# EAGLE design PLCArduinoV1 (EAGLE 8.6.3)
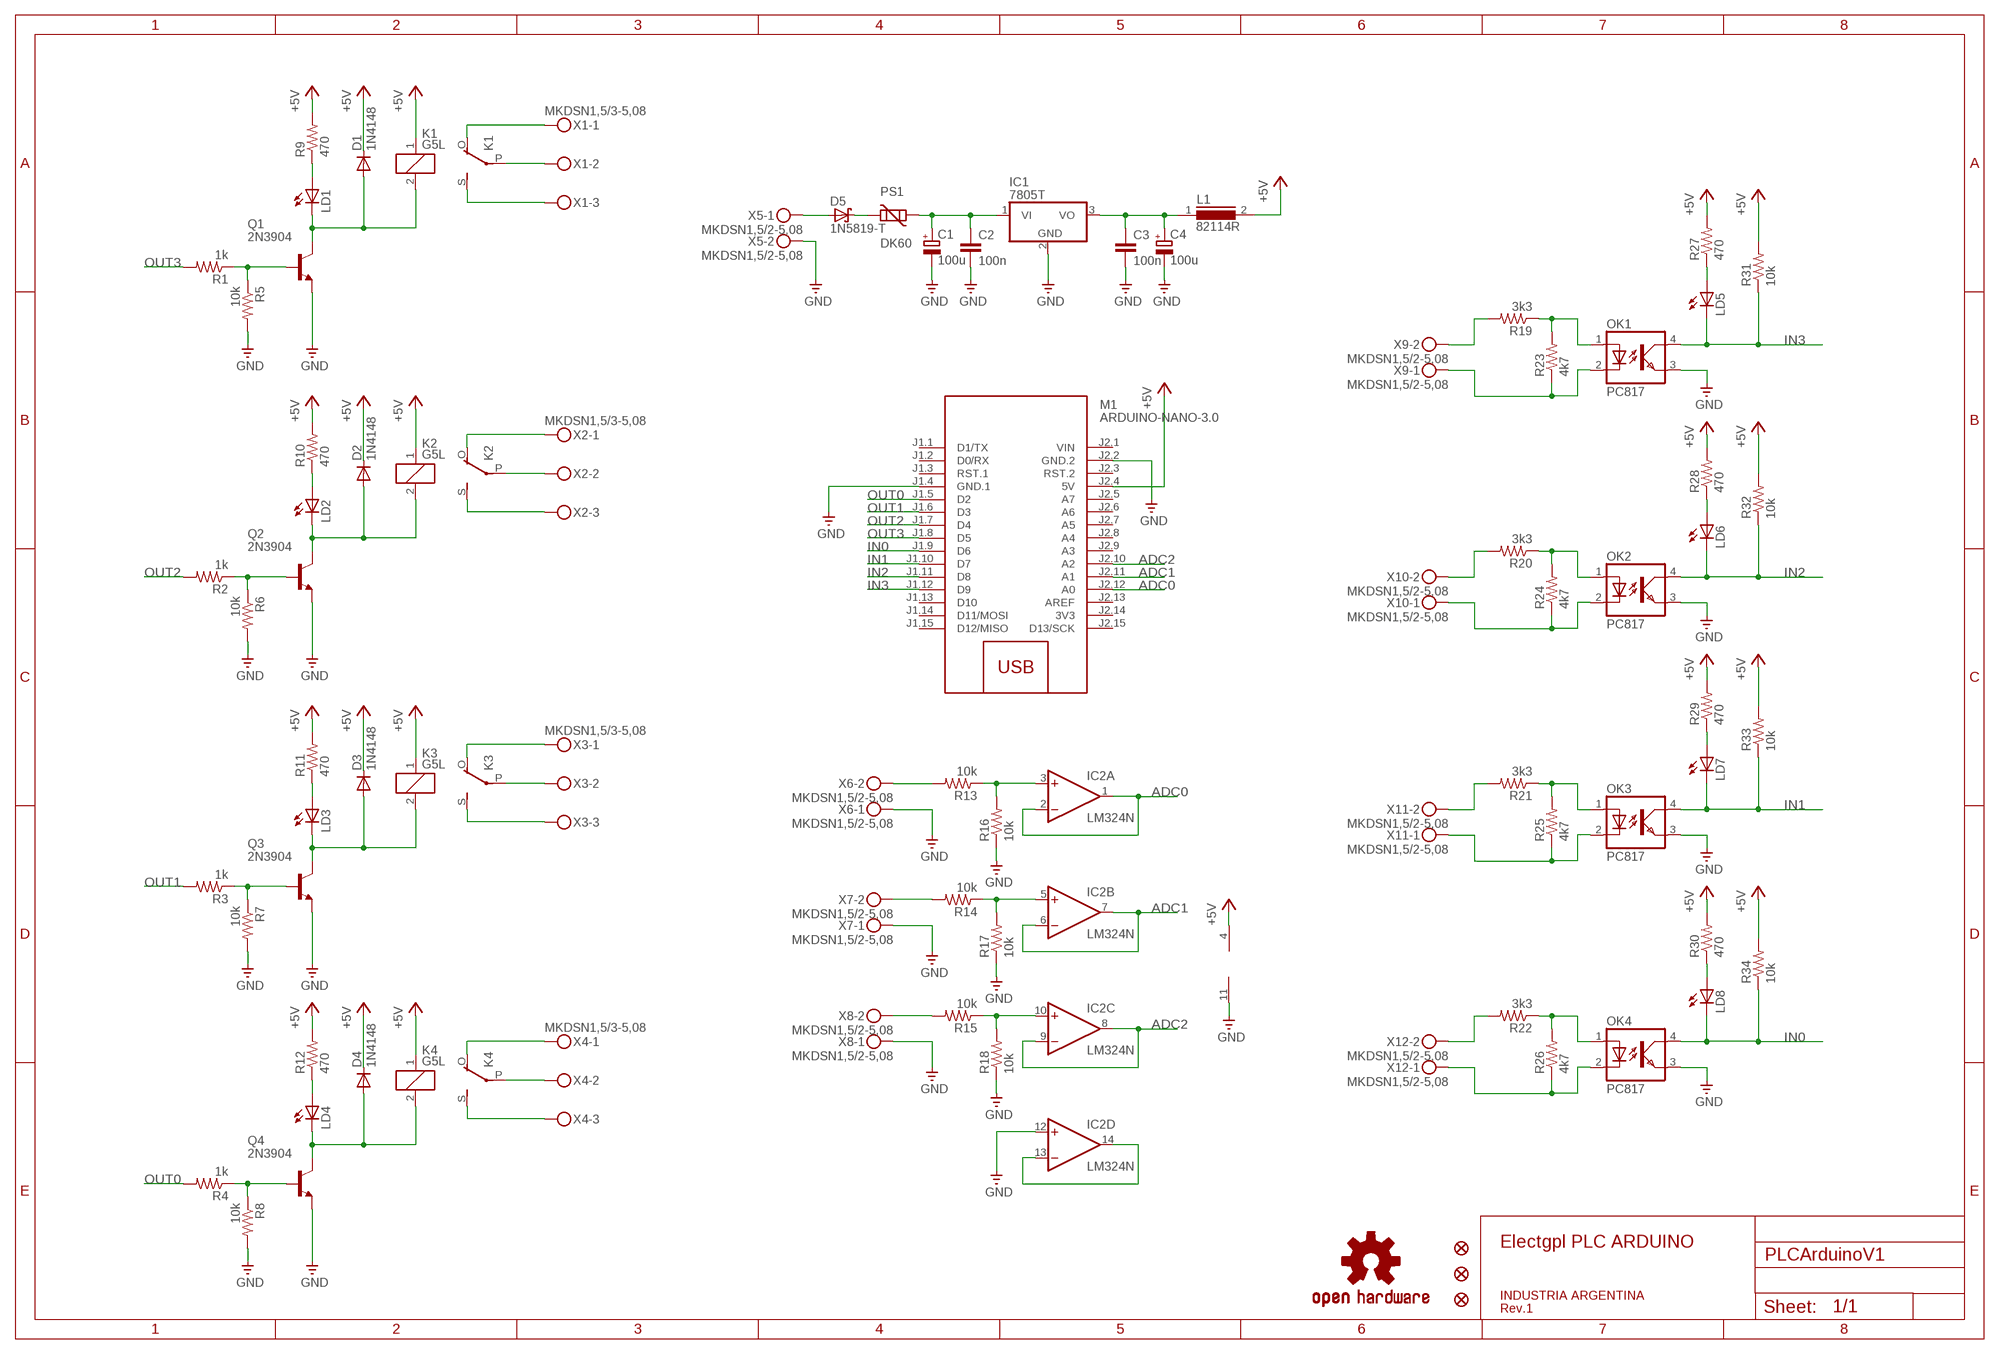
[diagram p0: schematic, sheet 1]

## Parts
C1  100u  CPOL-EUE3.5-8  [E3,5-8]
C2  100n  C-EU050-024X044  [C050-024X044]
C3  100n  C-EU050-024X044  [C050-024X044]
C4  100u  CPOL-EUE3.5-8  [E3,5-8]
D1  1N4148  [DO35-10]
D2  1N4148  [DO35-10]
D3  1N4148  [DO35-10]
D4  1N4148  [DO35-10]
D5  1N5819-T  [DO41-7.6]
IC1  7805T  [TO220H]
IC2  LM324N  [DIL14]
JP1  FIDUCIAL1X2.5  [FIDUCIAL-1X2.5]
JP2  FIDUCIAL1X2.5  [FIDUCIAL-1X2.5]
JP3  FIDUCIAL1X2.5  [FIDUCIAL-1X2.5]
K1  G5L  [G5LE]
K2  G5L  [G5LE]
K3  G5L  [G5LE]
K4  G5L  [G5LE]
L1  82114R  [82114R]
LD1  LED3MM  [LED3MM]
LD2  LED3MM  [LED3MM]
LD3  LED3MM  [LED3MM]
LD4  LED3MM  [LED3MM]
LD5  LED3MM  [LED3MM]
LD6  LED3MM  [LED3MM]
LD7  LED3MM  [LED3MM]
LD8  LED3MM  [LED3MM]
M1  ARDUINO-NANO-3.0  [ARDUINO-NANO-3.0]
OK1  PC817  [DIL04]
OK2  PC817  [DIL04]
OK3  PC817  [DIL04]
OK4  PC817  [DIL04]
PS1  DK60  POLYSWITCH5MM  [SO5K11]
Q1  2N3904  [TO92]
Q2  2N3904  [TO92]
Q3  2N3904  [TO92]
Q4  2N3904  [TO92]
R1  1k  R-US_0204/5  [0204/5]
R2  1k  R-US_0204/5  [0204/5]
R3  1k  R-US_0204/5  [0204/5]
R4  1k  R-US_0204/5  [0204/5]
R5  10k  R-US_0204/5  [0204/5]
R6  10k  R-US_0204/5  [0204/5]
R7  10k  R-US_0204/5  [0204/5]
R8  10k  R-US_0204/5  [0204/5]
R9  470  R-US_0204/5  [0204/5]
R10  470  R-US_0204/5  [0204/5]
R11  470  R-US_0204/5  [0204/5]
R12  470  R-US_0204/5  [0204/5]
R13  10k  R-US_0204/5  [0204/5]
R14  10k  R-US_0204/5  [0204/5]
R15  10k  R-US_0204/5  [0204/5]
R16  10k  R-US_0204/5  [0204/5]
R17  10k  R-US_0204/5  [0204/5]
R18  10k  R-US_0204/5  [0204/5]
R19  3k3  R-US_0204/5  [0204/5]
R20  3k3  R-US_0204/5  [0204/5]
R21  3k3  R-US_0204/5  [0204/5]
R22  3k3  R-US_0204/5  [0204/5]
R23  4k7  R-US_0204/5  [0204/5]
R24  4k7  R-US_0204/5  [0204/5]
R25  4k7  R-US_0204/5  [0204/5]
R26  4k7  R-US_0204/5  [0204/5]
R27  470  R-US_0204/5  [0204/5]
R28  470  R-US_0204/5  [0204/5]
R29  470  R-US_0204/5  [0204/5]
R30  470  R-US_0204/5  [0204/5]
R31  10k  R-US_0204/5  [0204/5]
R32  10k  R-US_0204/5  [0204/5]
R33  10k  R-US_0204/5  [0204/5]
R34  10k  R-US_0204/5  [0204/5]
U1  OSHW-LOGOM  [OSHW-LOGO-M]
X1  MKDSN1,5/3-5,08  [MKDSN1,5/3-5,08]
X2  MKDSN1,5/3-5,08  [MKDSN1,5/3-5,08]
X3  MKDSN1,5/3-5,08  [MKDSN1,5/3-5,08]
X4  MKDSN1,5/3-5,08  [MKDSN1,5/3-5,08]
X5  MKDSN1,5/2-5,08  [MKDSN1,5/2-5,08]
X6  MKDSN1,5/2-5,08  [MKDSN1,5/2-5,08]
X7  MKDSN1,5/2-5,08  [MKDSN1,5/2-5,08]
X8  MKDSN1,5/2-5,08  [MKDSN1,5/2-5,08]
X9  MKDSN1,5/2-5,08  [MKDSN1,5/2-5,08]
X10  MKDSN1,5/2-5,08  [MKDSN1,5/2-5,08]
X11  MKDSN1,5/2-5,08  [MKDSN1,5/2-5,08]
X12  MKDSN1,5/2-5,08  [MKDSN1,5/2-5,08]

## Nets
+5V: D1.C D2.C D3.C D4.C IC2.4(P:V+) K1.1 K2.1 K3.1 K4.1 L1.2 M1.J2.4(5V) R9.2 R10.2 R11.2 R12.2 R27.2 R28.2 R29.2 R30.2 R31.2 R32.2 R33.2 R34.2
ADC0: IC2.1(A:OUT) IC2.2(A:-IN) M1.J2.12(A0)
ADC1: IC2.6(B:-IN) IC2.7(B:OUT) M1.J2.11(A1)
ADC2: IC2.8(C:OUT) IC2.9(C:-IN) M1.J2.10(A2)
GND: C1.- C2.2 C3.2 C4.- IC1.2(GND) IC2.11(P:V-) IC2.12(D:+IN) M1.J1.4(GND.1) M1.J2.2(GND.2) OK1.3(EMIT) OK2.3(EMIT) OK3.3(EMIT) OK4.3(EMIT) Q1.3(E) Q2.3(E) Q3.3(E) Q4.3(E) R5.2 R6.2 R7.2 R8.2 R16.1 R17.1 R18.1 X5.2 X6.1 X7.1 X8.1
IN0: LD8.K(C) M1.J1.9(D6) OK4.4(COL) R34.1
IN1: LD7.K(C) M1.J1.10(D7) OK3.4(COL) R33.1
IN2: LD6.K(C) M1.J1.11(D8) OK2.4(COL) R32.1
IN3: LD5.K(C) M1.J1.12(D9) OK1.4(COL) R31.1
N$1: LD1.A R9.1
N$2: D1.A K1.2 LD1.K(C) Q1.1(C)
N$3: Q1.2(B) R1.1 R5.1
N$4: K1.P(2:P) X1.2
N$5: K1.O(2:O) X1.1
N$6: K1.S(2:S) X1.3
N$7: LD2.A R10.1
N$8: D2.A K2.2 LD2.K(C) Q2.1(C)
N$9: Q2.2(B) R2.1 R6.1
N$10: K2.P(2:P) X2.2
N$11: K2.O(2:O) X2.1
N$12: K2.S(2:S) X2.3
N$13: LD3.A R11.1
N$14: D3.A K3.2 LD3.K(C) Q3.1(C)
N$15: Q3.2(B) R3.1 R7.1
N$16: K3.P(2:P) X3.2
N$17: K3.O(2:O) X3.1
N$18: K3.S(2:S) X3.3
N$19: LD4.A R12.1
N$20: D4.A K4.2 LD4.K(C) Q4.1(C)
N$21: Q4.2(B) R4.1 R8.1
N$22: K4.P(2:P) X4.2
N$23: K4.O(2:O) X4.1
N$24: K4.S(2:S) X4.3
N$25: OK1.1(A) R19.1 R23.2
N$26: OK1.2(C) R23.1 X9.1
N$27: R13.2 X6.2
N$28: R14.2 X7.2
N$29: LD5.A R27.1
N$30: R19.2 X9.2
N$31: R15.2 X8.2
N$32: OK2.1(A) R20.1 R24.2
N$33: OK2.2(C) R24.1 X10.1
N$35: LD6.A R28.1
N$36: R20.2 X10.2
N$37: OK3.1(A) R21.1 R25.2
N$38: OK3.2(C) R25.1 X11.1
N$39: D5.A X5.1
N$40: LD7.A R29.1
N$41: R21.2 X11.2
N$42: OK4.1(A) R22.1 R26.2
N$43: OK4.2(C) R26.1 X12.1
N$44: D5.C PS1.2
N$45: LD8.A R30.1
N$46: R22.2 X12.2
N$47: C1.+ C2.1 IC1.1(VI) PS1.1
N$49: C3.1 C4.+ IC1.3(VO) L1.1
N$53: IC2.3(A:+IN) R13.1 R16.2
N$54: IC2.5(B:+IN) R14.1 R17.2
N$55: IC2.10(C:+IN) R15.1 R18.2
N$56: IC2.13(D:-IN) IC2.14(D:OUT)
OUT0: M1.J1.5(D2) R4.2
OUT1: M1.J1.6(D3) R3.2
OUT2: M1.J1.7(D4) R2.2
OUT3: M1.J1.8(D5) R1.2
Unconnected: M1.J1.1(D1/TX) M1.J1.2(D0/RX) M1.J1.3(RST.1) M1.J1.13(D10) M1.J1.14(D11/MOSI) M1.J1.15(D12/MISO) M1.J2.3(RST.2) M1.J2.5(A7) M1.J2.6(A6) M1.J2.7(A5) M1.J2.8(A4) M1.J2.9(A3) M1.J2.13(AREF) M1.J2.15(D13/SCK)

## Notes on the sheet
- Electgpl PLC ARDUINO
- INDUSTRIA ARGENTINA
- Rev.1

## Power pins joined to a net without a drawn wire
3V3: M1.J2.14(3V3)
VIN: M1.J2.1(VIN)

## Library data of the parts
C1 C4 = rcl:CPOL-EU: POLARIZED CAPACITOR, European symbol; SPICEPREFIX: C
C2 C3 = rcl:C-EU: CAPACITOR, European symbol; SPICEPREFIX: C
D1-D4 = diode:1N4148: DIODE high speed (Philips)
D5 = diode:1N581*: 1.0A SCHOTTKY BARRIER RECTIFIER Source: http://www.diodes.com/datasheets/ds23001.pdf
IC1 = linear:78*: Positive VOLTAGE REGULATOR Source: http://cache.national.com/ds/LM/LM78L05.pdf http://www.fairchildsemi.com/ds/LM/LM7805.pdf
IC2 = linear:LM324: OP AMP
JP1-JP3 = SparkFun-Aesthetics:FIDUCIAL: Fiducial Alignment Points Various fiducial points for machine vision alignment.
K1-K4 = relay:G5L: RELAY 1 x switch, 10 A/120 V AC, 8 A/30 V ADC, Omron
L1 = inductors:82114R: INDUCTOR; SPICEPREFIX: L
LD1-LD8 = led:LED: LED OSRAM: - CHIPLED LG R971, LG N971, LY N971, LG Q971, LY Q971, LO R971, LY R971 LH N974, LH R974 LS Q976, LO Q976, LY Q976 LO Q996 - Hyper CHIPLED LW Q18S LB Q993, LB Q99A, LB R99A - SideLED LS A670, LO A670, LY A670, LG A670, LP A670 LB A673, LV A673, LT A673, LW A673 LH A674 LY A675 LS A676, LA A676, LO A676, LY A676, LW A676 LS A679, LY A679, LG A679 - Hyper Micro SIDELED® LS Y876, LA Y876, LO Y876, LY Y876 LT Y87S - SmartLED LW L88C, LW L88S LB L89C, LB L89S, LG L890 LS L89K, LO L89K, LY L89K LS L896, LA L896, LO L896, LY L896 - TOPLED LS T670, LO T670, LY T670, LG T670, LP T670 LSG T670, LSP T670, LSY T670, LOP T670, LYG T670 LG T671, LOG T671, LSG T671 LB T673, LV T673, LT T673, LW T673 LH T674 LS T676, LA T676, LO T676, LY T676, LB T676, LH T676, LSB T676, LW T676 LB T67C, LV T67C, LT T67C, LS T67K, LO T67K, LY T67K, LW E67C LS E67B, LA E67B, LO E67B, LY E67B, LB E67C, LV E67C, LT E67C LW T67C LS T679, LY T679, LG T679 LS T770, LO T770, LY T770, LG T770, LP T770 LB T773, LV T773, LT T773, LW T773 LH T774 LS E675, LA E675, LY E675, LS T675 LS T776, LA T776, LO T776, LY T776, LB T776 LHGB T686 LT T68C, LB T68C - Hyper Mini TOPLED® LB M676 - Mini TOPLED Santana® LG M470 LS M47K, LO M47K, LY M47K Source: http://www.osram.convergy.de/
M1 = diy-modules:ARDUINO-NANO-3.0: Arduino Nano 3.0 and compatible devices More details available here: https://www.arduino.cc/en/Main/ArduinoBoardNano Click here to find device on ebay.com <http://www.ebay.com/sch/arduino+nano>
OK1-OK4 = optocoupler-2:PC817: SHARP OPTO COUPLER
PS1 = my_mixed:POLYSWITCH
Q1-Q4 = transistor-npn:2N3904: NPN Transistor
R1-R34 = rcl:R-US_: RESISTOR, American symbol; SPICEPREFIX: R
U1 = SparkFun:OSHW-LOGO: Open Source Hardware Logo This logo indicates the piece of hardware it is found on incorporates a OSHW license and/or adheres to the definition of open source hardware found here: http://freedomdefined.org/OSHW
X1-X4 = con-phoenix-508:MKDSN1,5/3-5,08: MKDSN 1,5/ 3-5,08 Printklemme Nennstrom: 13,5 A Nennspannung: 250 V Rastermaß: 5,08 mm Polzahl: 3 Anschlussart: Schraubanschluss Montage: Löten Anschlussrichtung Leiter/Platine: 0 ° Artikelnummer: 1729131 Source: http://eshop.phoenixcontact.com .. 1729131.pdf
X5-X12 = con-phoenix-508:MKDSN1,5/2-5,08: MKDSN 1,5/ 2-5,08 Printklemme Nennstrom: 13,5 A Nennspannung: 250 V Rastermaß: 5,08 mm Polzahl: 2 Anschlussart: Schraubanschluss Montage: Löten Anschlussrichtung Leiter/Platine: 0 ° Artikelnummer: 1729128 Source: http://eshop.phoenixcontact.com .. 1729128.pdf

## Board
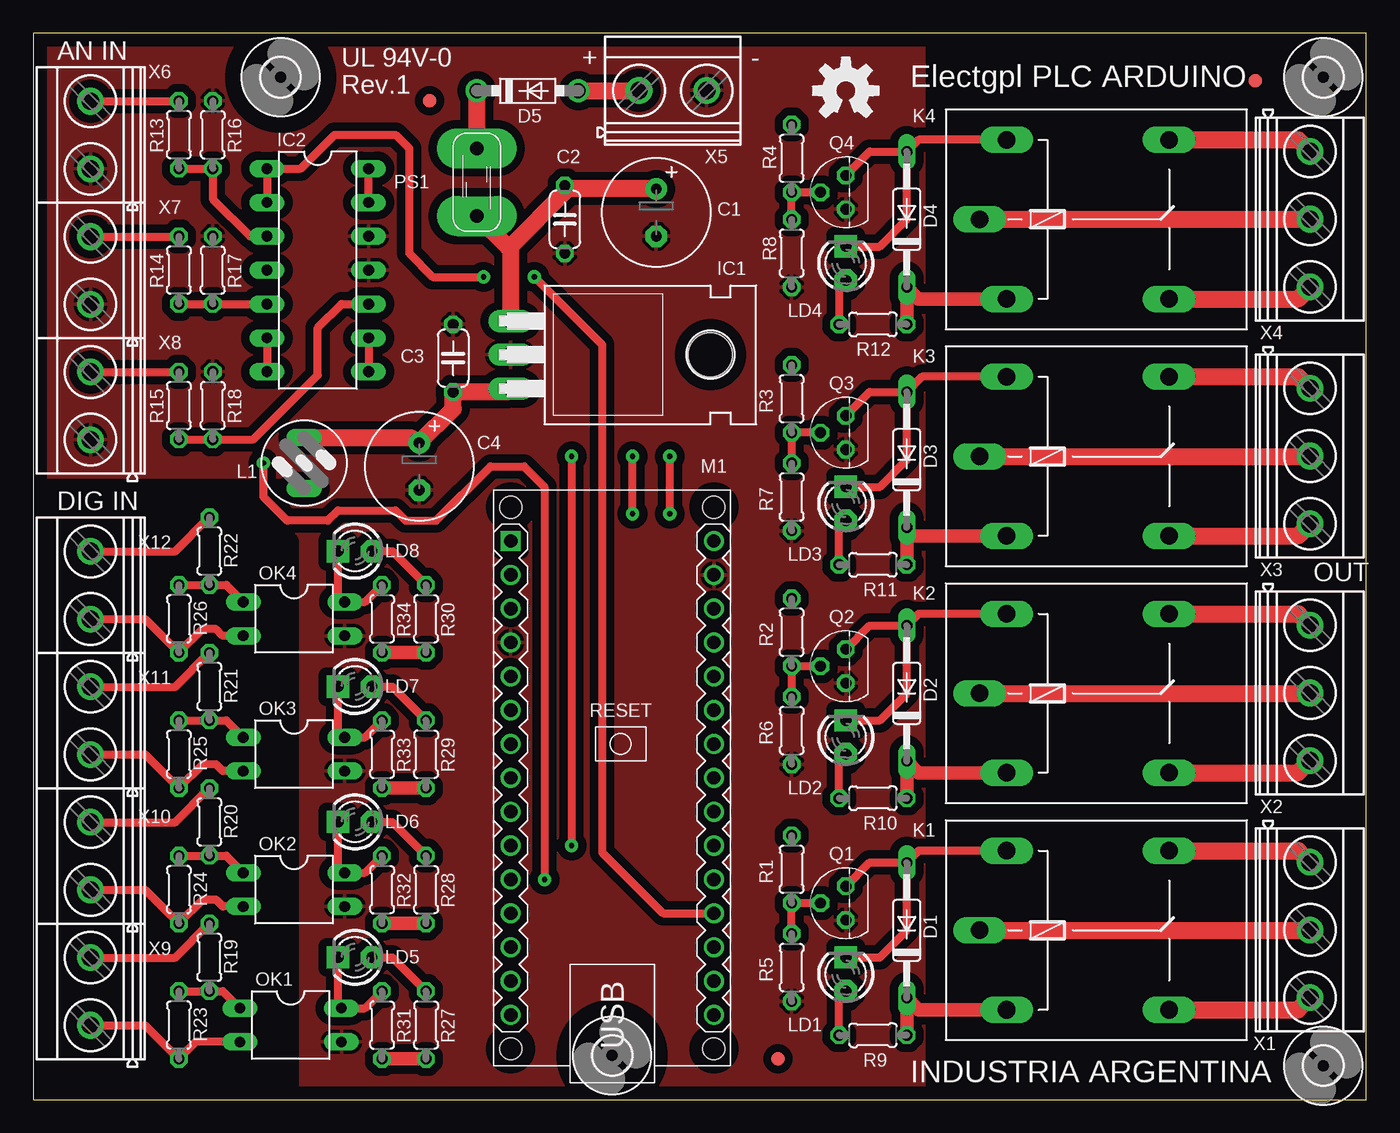
[diagram p1: board, top side]
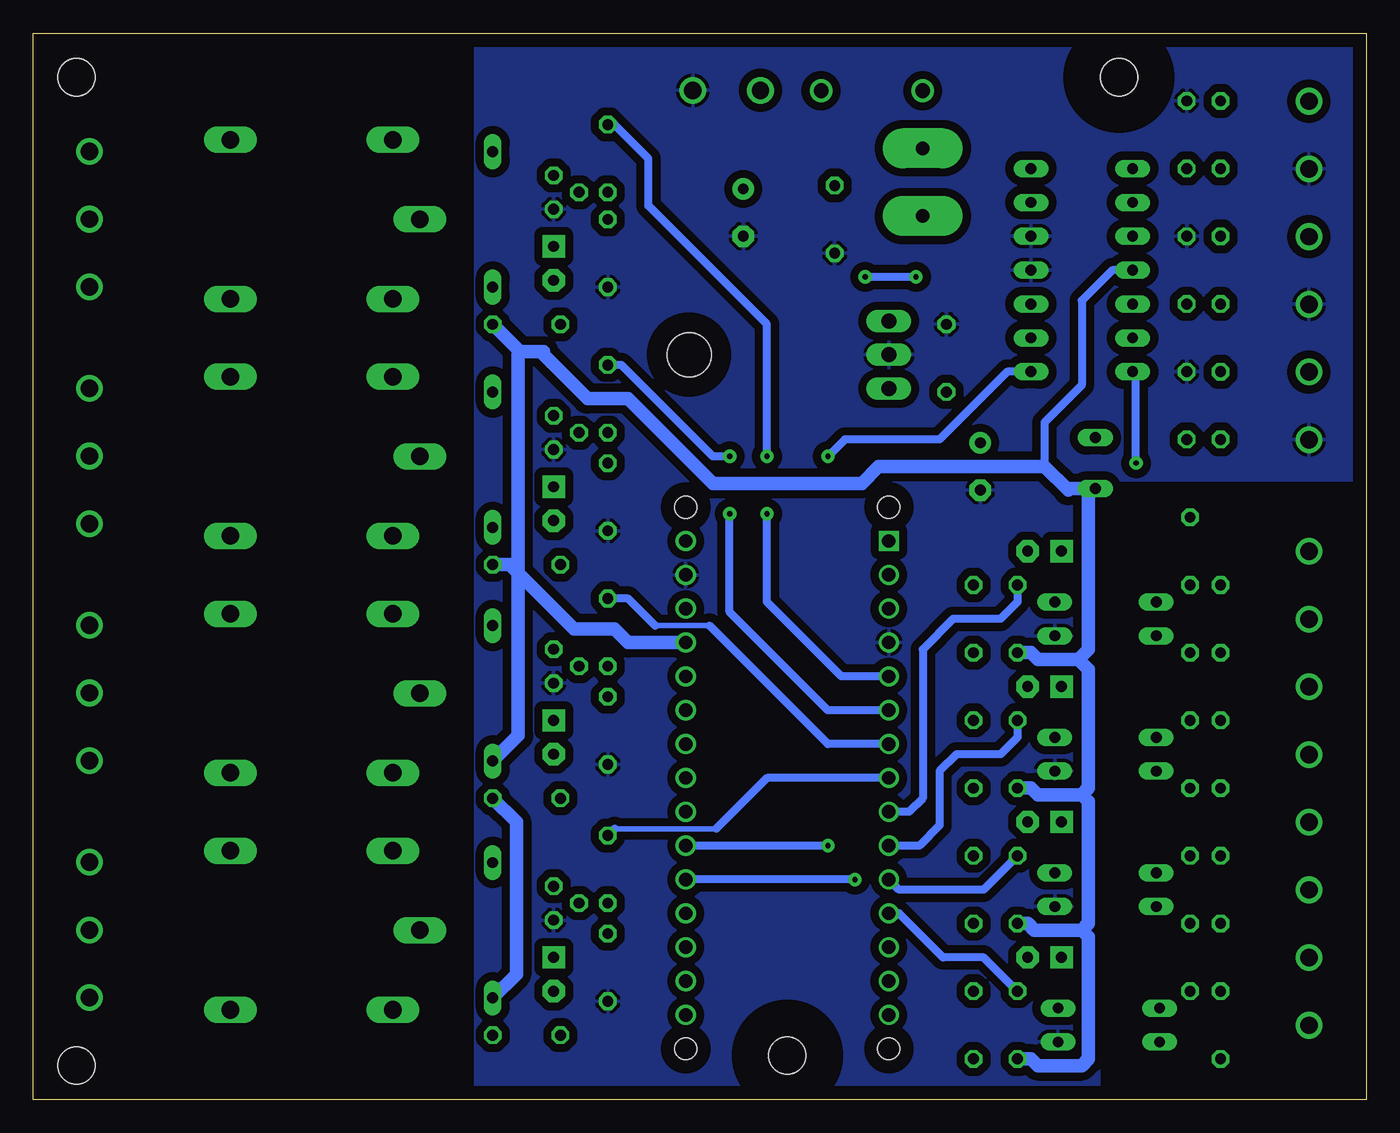
[diagram p2: board, bottom side, seen from below]

Size 100 x 80 mm. Coordinates in mm from the lower left corner, seen from the top.
Outline: 0,0 100,0 100,80 0,80 0,0
Copper layers (1*16): Top 0.035mm / dielectric 1.5mm / Bottom 0.035mm
Design rules "default": minimum track width 6mil, minimum drill 0.35mm, track to track 6mil, track to pad 6mil, pad to pad 6mil, via to via 6mil, smd to smd 6mil, copper to edge 40mil, drill to drill 6mil, minimum pad ring 10mil, minimum via ring 8mil, stop-mask expansion 4mil, vias tented up to drill 0mil, thermal gap 10mil
tRestrict: area 1,1 to 19.3,41.9; area 0.8,41.9 to 18.5,46; area 67.6,0.5 to 99.6,79.2
bRestrict: area 0.5,0.5 to 19.3,41.9; area 0.8,41.7 to 18.5,45.7; area 67.6,0.5 to 99.3,79.2

### Footprints (pad centres in the part's own frame; a part is rotated, then mirrored left to right if it is on the bottom)
E3,5-8 = drill 0.813 pad 1.6: + -1.778,0 | drill 0.813 pad 1.6 octagon: - 1.778,0
C050-024X044 = drill 0.813 octagon: 1 -2.54,0; 2 2.54,0
DO35-10 = drill 0.813 long: A 5.08,0; C -5.08,0
DO41-7.6 = drill 1.1 pad 1.7: A 3.81,0; C -3.81,0
TO220H = drill 1.118 long: 1 -2.54,-10.16; 2 0,-10.16; 3 2.54,-10.16 | hole 3.302: 0,4.826
DIL14 = drill 0.813 long: 1 -7.62,-3.81; 2 -5.08,-3.81; 3 -2.54,-3.81; 4 0,-3.81; 5 2.54,-3.81; 6 5.08,-3.81; 7 7.62,-3.81; 8 7.62,3.81; 9 5.08,3.81; 10 2.54,3.81; 11 0,3.81; 12 -2.54,3.81; 13 -5.08,3.81; 14 -7.62,3.81
FIDUCIAL-1X2.5 = smd 1 x 1: 1 0,0
G5LE = drill 1.321 long: 1 -7.493,-5.969; 2 -7.493,5.969; O 4.699,5.969; P -9.525,0; S 4.699,-5.969
82114R = drill 0.813 long: 1 0,1.905; 2 0,-1.905
LED3MM = drill 0.813 pad 1.676 octagon: A -1.27,0 | drill 0.813 pad 1.676 square: K 1.27,0
ARDUINO-NANO-3.0 = drill 1 square: J1.1 17.78,7.62 | drill 1: J1.2 15.24,7.62; J1.3 12.7,7.62; J1.4 10.16,7.62; J1.5 7.62,7.62; J1.6 5.08,7.62; J1.7 2.54,7.62; J1.8 0,7.62; J1.9 -2.54,7.62; J1.10 -5.08,7.62; J1.11 -7.62,7.62; J1.12 -10.16,7.62; J1.13 -12.7,7.62; J1.14 -15.24,7.62; J1.15 -17.78,7.62; J2.1 17.78,-7.62; J2.2 15.24,-7.62; J2.3 12.7,-7.62; J2.4 10.16,-7.62; J2.5 7.62,-7.62; J2.6 5.08,-7.62; J2.7 2.54,-7.62; J2.8 0,-7.62; J2.9 -2.54,-7.62; J2.10 -5.08,-7.62; J2.11 -7.62,-7.62; J2.12 -10.16,-7.62; J2.13 -12.7,-7.62; J2.14 -15.24,-7.62; J2.15 -17.78,-7.62 | hole 1.651: -20.32,7.62; -20.32,-7.62; 20.32,-7.62; 20.32,7.62
DIL04 = drill 0.813 long: 1 -1.27,-3.81; 2 1.27,-3.81; 3 1.27,3.81; 4 -1.27,3.81
SO5K11 = drill 1 pad 3 long: 1 0,-2.54; 2 0,2.54
TO92 = drill 0.813 octagon: 1 1.27,0; 2 0,1.905; 3 -1.27,0
0204/5 = drill 0.813 octagon: 1 -2.54,0; 2 2.54,0
2,8 = hole 2.8: 0,0
MKDSN1,5/3-5,08 = drill 1.3 pad 2: 1 -7.641,0.025; 2 -2.561,0.025; 3 2.519,0.025
MKDSN1,5/2-5,08 = drill 1.3 pad 2: 1 -2.561,0.025; 2 2.519,0.025

### Placement (x,y rotation side)
C1  46.74,66.55 270 top
C2  39.88,66.04 270 top
C3  31.5,55.63 90 top
C4  28.96,47.5 270 top
D1  65.53,12.7 90 top
D2  65.53,30.48 90 top
D3  65.53,48.01 90 top
D4  65.53,66.04 90 top
D5  37.08,75.69 0 top
IC1  45.97,55.88 270 top
IC2  21.34,62.23 270 top
JP1  91.69,76.45 0 top
JP2  29.72,74.93 0 top
JP3  55.88,3.05 0 top
K1  80.52,12.7 0 top
K2  80.52,30.48 0 top
K3  80.52,48.26 0 top
K4  80.52,66.04 0 top
L1  20.32,47.75 0 top
LD1  60.96,9.4 90 top
LD2  60.96,27.18 90 top
LD3  60.96,44.7 90 top
LD4  60.96,62.74 90 top
LD5  24.13,10.67 180 top
LD6  24.13,20.83 180 top
LD7  24.13,30.99 180 top
LD8  24.13,41.15 180 top
M1  43.43,24.13 90 top
OK1  19.3,5.59 270 top
OK2  19.56,15.75 270 top
OK3  19.56,25.91 270 top
OK4  19.56,36.07 270 top
PS1  33.27,68.83 0 top
Q1  60.96,14.73 90 top
Q2  60.96,32.51 90 top
Q3  60.96,50.04 90 top
Q4  60.96,68.07 90 top
R1  56.9,17.27 90 top
R2  56.9,35.05 90 top
R3  56.9,52.58 90 top
R4  56.9,70.61 90 top
R5  56.9,9.91 270 top
R6  56.9,27.69 270 top
R7  56.9,45.21 270 top
R8  56.9,63.5 270 top
R9  62.99,4.83 0 top
R10  62.99,22.61 0 top
R11  62.99,40.13 0 top
R12  62.99,58.17 0 top
R13  10.92,72.39 90 top
R14  10.92,62.23 90 top
R15  10.92,52.07 90 top
R16  13.46,72.39 270 top
R17  13.46,62.23 270 top
R18  13.46,52.07 270 top
R19  13.21,10.67 90 top
R20  13.21,20.83 90 top
R21  13.21,30.99 90 top
R22  13.21,41.15 90 top
R23  10.92,5.59 90 top
R24  10.92,15.75 90 top
R25  10.92,25.91 90 top
R26  10.92,36.07 90 top
R27  29.46,5.59 270 top
R28  29.46,15.75 270 top
R29  29.46,25.91 270 top
R30  29.46,36.07 270 top
R31  26.16,5.59 270 top
R32  26.16,15.75 270 top
R33  26.16,25.91 270 top
R34  26.16,36.07 270 top
U1  60.96,75.69 0 top
U$2  [2,8]  96.77,76.71 0 top
U$3  [2,8]  96.77,2.54 0 top
U$4  [2,8]  18.54,76.71 0 top
U$5  [2,8]  43.43,3.3 0 top
X1  95.76,10.16 270 top
X2  95.76,27.94 270 top
X3  95.76,45.72 270 top
X4  95.76,63.5 270 top
X5  48.01,75.69 0 top
X6  4.32,72.39 90 top
X7  4.32,62.23 90 top
X8  4.32,52.07 90 top
X9  4.32,8.13 90 top
X10  4.32,18.29 90 top
X11  4.32,28.45 90 top
X12  4.32,38.61 90 top

### Tracks (layer width: path | path; a pad name or v marks a point on that pad's centre or on a via)
+5V
  Top 0.61: 66.17,42.29 D3.C
  Top 1.016: K4.1 66.42,60.07 D4.C R12.2 | K3.1 66.17,42.29 | K2.1 66.42,24.51 D2.C R10.2 | K1.1 66.42,6.73 D1.C R9.2 | R11.2 D3.C | R31.2 R27.2 | R32.2 R28.2 | R33.2 R29.2 | R34.2 R30.2
  Bottom 0.61: IC2.4 19.05,62.23 21.34,59.94 21.34,53.59 24.13,50.8 24.13,47.5 | 22.35,45.72 22.23,45.85 | 20.83,45.34 L1.2 | 63.63,56.26 63.63,55.88 63.37,56.13 | 61.72,55.88 61.72,56.13
  Bottom 1.016: 22.35,45.72 24.13,47.5 36.58,47.5 37.85,46.23 49.02,46.23 55.37,52.58 58.42,52.58 61.72,55.88 | 22.23,45.85 L1.2 | R34.2 25.15,33.53 24.64,33.02 21.59,33.02 | 21.59,33.02 20.83,33.78 20.83,45.34 | R33.2 25.15,23.37 24.64,22.86 21.34,22.86 | 21.34,22.86 20.83,23.37 20.83,32.26 21.59,33.02 | R32.2 25.4,13.21 24.89,12.7 21.34,12.7 | 21.34,12.7 20.83,13.21 20.83,22.35 21.34,22.86 | R31.2 25.15,3.05 24.64,2.54 21.34,2.54 20.83,3.05 20.83,12.19 21.34,12.7 | M1.J2.4 55.37,34.29 56.39,35.31 59.44,35.31 63.63,39.5 | 63.63,39.5 64.26,40.13 R11.2 | D2.C 63.63,27.3 63.63,39.5 | 63.63,39.5 63.63,55.88 | 63.63,56.26 R12.2 | D1.C 63.75,9.4 63.75,20.83 R10.2 | 61.72,56.13 63.37,56.13
ADC0  (via drill 0.4 pad 1)
  Top 0.61: IC2.2 IC2.1 20.07,69.85 22.61,72.39 27.18,72.39 28.19,71.37 28.19,63.5 29.97,61.72 v33.78,61.72 | v37.59,61.72 42.67,56.64 42.67,18.54 47.24,13.97 M1.J2.12
  Bottom 0.61: v33.78,61.72 v37.59,61.72
ADC1  (via drill 0.4 pad 1)
  Top 0.61: IC2.6 IC2.7 | v38.35,16.51 38.35,45.97 36.83,47.5 34.29,47.5 30.23,43.43 27.94,43.43 27.18,44.2 22.86,44.2 22.1,43.43 19.05,43.43 17.27,45.21 v17.27,47.75
  Bottom 0.61: v38.35,16.51 M1.J2.11 | IC2.7 17.27,54.36 v17.27,47.75
ADC2  (via drill 0.4 pad 1)
  Top 0.61: IC2.9 IC2.8 | v40.39,48.26 v40.39,19.05
  Bottom 0.61: IC2.8 26.92,54.61 32,49.53 39.12,49.53 v40.39,48.26 | v40.39,19.05 M1.J2.10
GND
  pour Bottom (isolate 0.61): 0,80.01 100.33,80.01 100.33,0 0,0
  pour Top (isolate 0.61): 0,80.01 100.33,80.01 100.33,0 0,0
IN0
  Top 0.61: LD8.K 22.86,37.85 OK4.4 24.89,37.34 R34.1
  Bottom 0.61: R34.1 26.16,37.34 27.43,36.07 30.99,36.07 33.27,33.78 33.27,22.61 34.29,21.59 M1.J1.9
IN1
  Top 0.61: LD7.K 22.86,27.69 OK3.4 24.89,27.18 R33.1
  Bottom 0.61: R33.1 26.16,27.18 27.43,25.91 30.73,25.91 32,24.64 32,20.57 33.53,19.05 M1.J1.10
IN2
  Top 0.61: LD6.K 22.86,17.53 OK2.4 24.89,17.02 R32.1
  Bottom 0.61: R32.1 28.7,15.75 35.05,15.75 M1.J1.11
IN3
  Top 0.61: LD5.K 22.86,7.11 OK1.4 24.89,6.86 R31.1
  Bottom 0.61: R31.1 28.7,10.67 31.75,10.67 35.05,13.97 M1.J1.12
N$1
  Top 0.61: R9.1 60.45,7.62 LD1.A
N$2
  Top 0.61: Q1.1 62.74,17.78 D1.A | K1.2 66.42,18.67 D1.A | LD1.K 63.5,10.67 65.53,12.7 D1.A
N$3
  Top 0.61: Q1.2 R1.1 R5.1
N$4
  Top 0.61: 95.76,12.7 X1.2
  Top 1.27: K1.P 95.76,12.7
N$5
  Top 1.27: K1.O 94.92,18.67 X1.1
N$6
  Top 1.27: K1.S 94.87,6.73 X1.3
N$7
  Top 0.61: R10.1 60.45,25.4 LD2.A
N$8
  Top 0.61: K2.2 66.42,36.45 D2.A | Q2.1 62.74,35.56 D2.A | LD2.K 63.5,28.45 65.53,30.48 D2.A
N$9
  Top 0.61: Q2.2 R2.1 R6.1
N$10
  Top 0.61: 95.76,30.48 X2.2
  Top 1.27: K2.P 95.76,30.48
N$11
  Top 1.27: K2.O 94.92,36.45 X2.1
N$12
  Top 1.27: K2.S 94.87,24.51 X2.3
N$13
  Top 0.61: R11.1 60.45,42.93 LD3.A
N$14
  Top 0.61: K3.2 66.67,54.23 D3.A | LD3.K 63.5,45.97 65.53,48.01 D3.A | Q3.1 62.74,53.09 D3.A
N$15
  Top 0.61: Q3.2 R3.1 R7.1
N$16
  Top 0.61: 95.76,48.26 X3.2
  Top 1.27: K3.P 95.76,48.26
N$17
  Top 1.27: K3.O 94.92,54.23 X3.1
N$18
  Top 1.27: K3.S 94.87,42.29 X3.3
N$19
  Top 0.61: LD4.A 60.45,60.96 R12.1
N$20
  Top 0.61: K4.2 66.42,72.01 D4.A | Q4.1 62.74,71.12 D4.A | LD4.K 63.5,64.01 65.53,66.04 D4.A
N$21
  Top 0.61: Q4.2 R4.1 R8.1
N$22
  Top 0.61: 95.76,66.04 X4.2
  Top 1.27: K4.P 95.76,66.04
N$23
  Top 1.27: K4.O 94.92,72.01 X4.1
N$24
  Top 1.27: K4.S 94.87,60.07 X4.3
N$25
  Top 0.61: R23.2 R19.1 14.22,8.13 OK1.1
N$26
  Top 0.61: X9.1 8.4,5.57 R23.1 12.19,4.32 OK1.2
N$27
  Top 0.61: X6.2 10.9,74.91 R13.2
N$28
  Top 0.61: X7.2 10.9,64.75 R14.2
N$29
  Top 0.61: LD5.A 26.92,10.67 R27.1
N$30
  Top 0.61: X9.2 10.65,10.65 R19.2
N$31
  Top 0.61: X8.2 10.9,54.59 R15.2
N$32
  Top 0.61: R24.2 R20.1 14.48,18.29 OK2.1
N$33
  Top 0.61: X10.1 8.4,15.73 R24.1 12.7,14.99 13.72,14.99 14.22,14.48 OK2.2
N$35
  Top 0.61: LD6.A 26.92,20.83 R28.1
N$36
  Top 0.61: X10.2 10.65,20.81 R20.2
N$37
  Top 0.61: R25.2 R21.1 14.48,28.45 OK3.1
N$38
  Top 0.61: X11.1 8.4,25.89 R25.1 12.7,25.15 13.72,25.15 14.22,24.64 OK3.2
N$39
  Top 0.61: 45.42,75.69 X5.1
  Top 1.27: D5.A 45.42,75.69
N$40
  Top 0.61: LD7.A 26.92,30.99 R29.1
N$41
  Top 0.61: X11.2 10.65,30.97 R21.2
N$42
  Top 0.61: R26.2 R22.1 14.48,38.61 OK4.1
N$43
  Top 0.61: X12.1 8.4,36.05 R26.1 12.7,35.31 13.72,35.31 14.22,34.8 OK4.2
N$44
  Top 1.27: D5.C PS1.2
N$45
  Top 0.61: LD8.A 26.92,41.15 R30.1
N$46
  Top 0.61: X12.2 10.65,41.13 R22.2
N$47
  Top 0.61: 35.69,63.88 35.81,63.75
  Top 1.27: PS1.1 35.69,63.88 40.13,68.33 | 35.81,63.75 IC1.1 | C1.+ 40.13,68.33 | 40.13,68.33 C2.1
N$49
  Top 0.61: IC1.3 35.56,53.09
  Top 1.27: 35.56,53.09 C3.1 31.5,51.82 C4.+ 28.32,49.66 L1.1
N$53
  Top 0.61: R13.1 R16.2 13.46,67.56 16.26,64.77 IC2.3
N$54
  Top 0.61: R14.1 R17.2 IC2.5
N$55
  Top 0.61: R15.1 R18.2 16.51,49.53 21.34,54.36 21.34,57.91 23.11,59.69 IC2.10
N$56
  Top 0.61: IC2.13 IC2.14
OUT0  (via drill 0.4 pad 1)
  Top 0.61: v44.96,43.94 v44.96,48.26
  Bottom 0.61: M1.J1.5 39.37,31.75 44.96,37.34 v44.96,43.94 | v44.96,48.26 44.96,58.17 53.85,67.06 53.85,70.61 56.39,73.15 R4.2
OUT1  (via drill 0.4 pad 1)
  Top 0.61: v47.75,43.94 v47.75,48.26
  Bottom 0.61: M1.J1.6 40.39,29.21 47.75,36.58 v47.75,43.94 | v47.75,48.26 49.02,48.26 55.88,55.12 R3.2
OUT2
  Bottom 0.406: 49.28,35.56 53.34,35.56
  Bottom 0.61: M1.J1.7 40.39,26.67 49.28,35.56 | 53.34,35.56 55.37,37.59 R2.2
OUT3
  Bottom 0.406: 48.77,20.32 56.39,20.32
  Bottom 0.61: M1.J1.8 44.96,24.13 48.77,20.32 | 56.39,20.32 R1.2

### Text on the board
tNames: AN IN | UL 94V-0 | + | - | Electgpl PLC ARDUINO | Rev.1 | DIG IN | OUT | INDUSTRIA ARGENTINA